# EasyEDA Pro project 电机控制板.epro

# Schematic Schematic1_2
Create Date: 2024-06-06; Page Name: P1; Project Name: 非小车电路板; Schematic Name: Schematic1_2; Update Date: 2024-06-06; Company: 嘉立创EDA; Page Size: A4; Version: V1.0
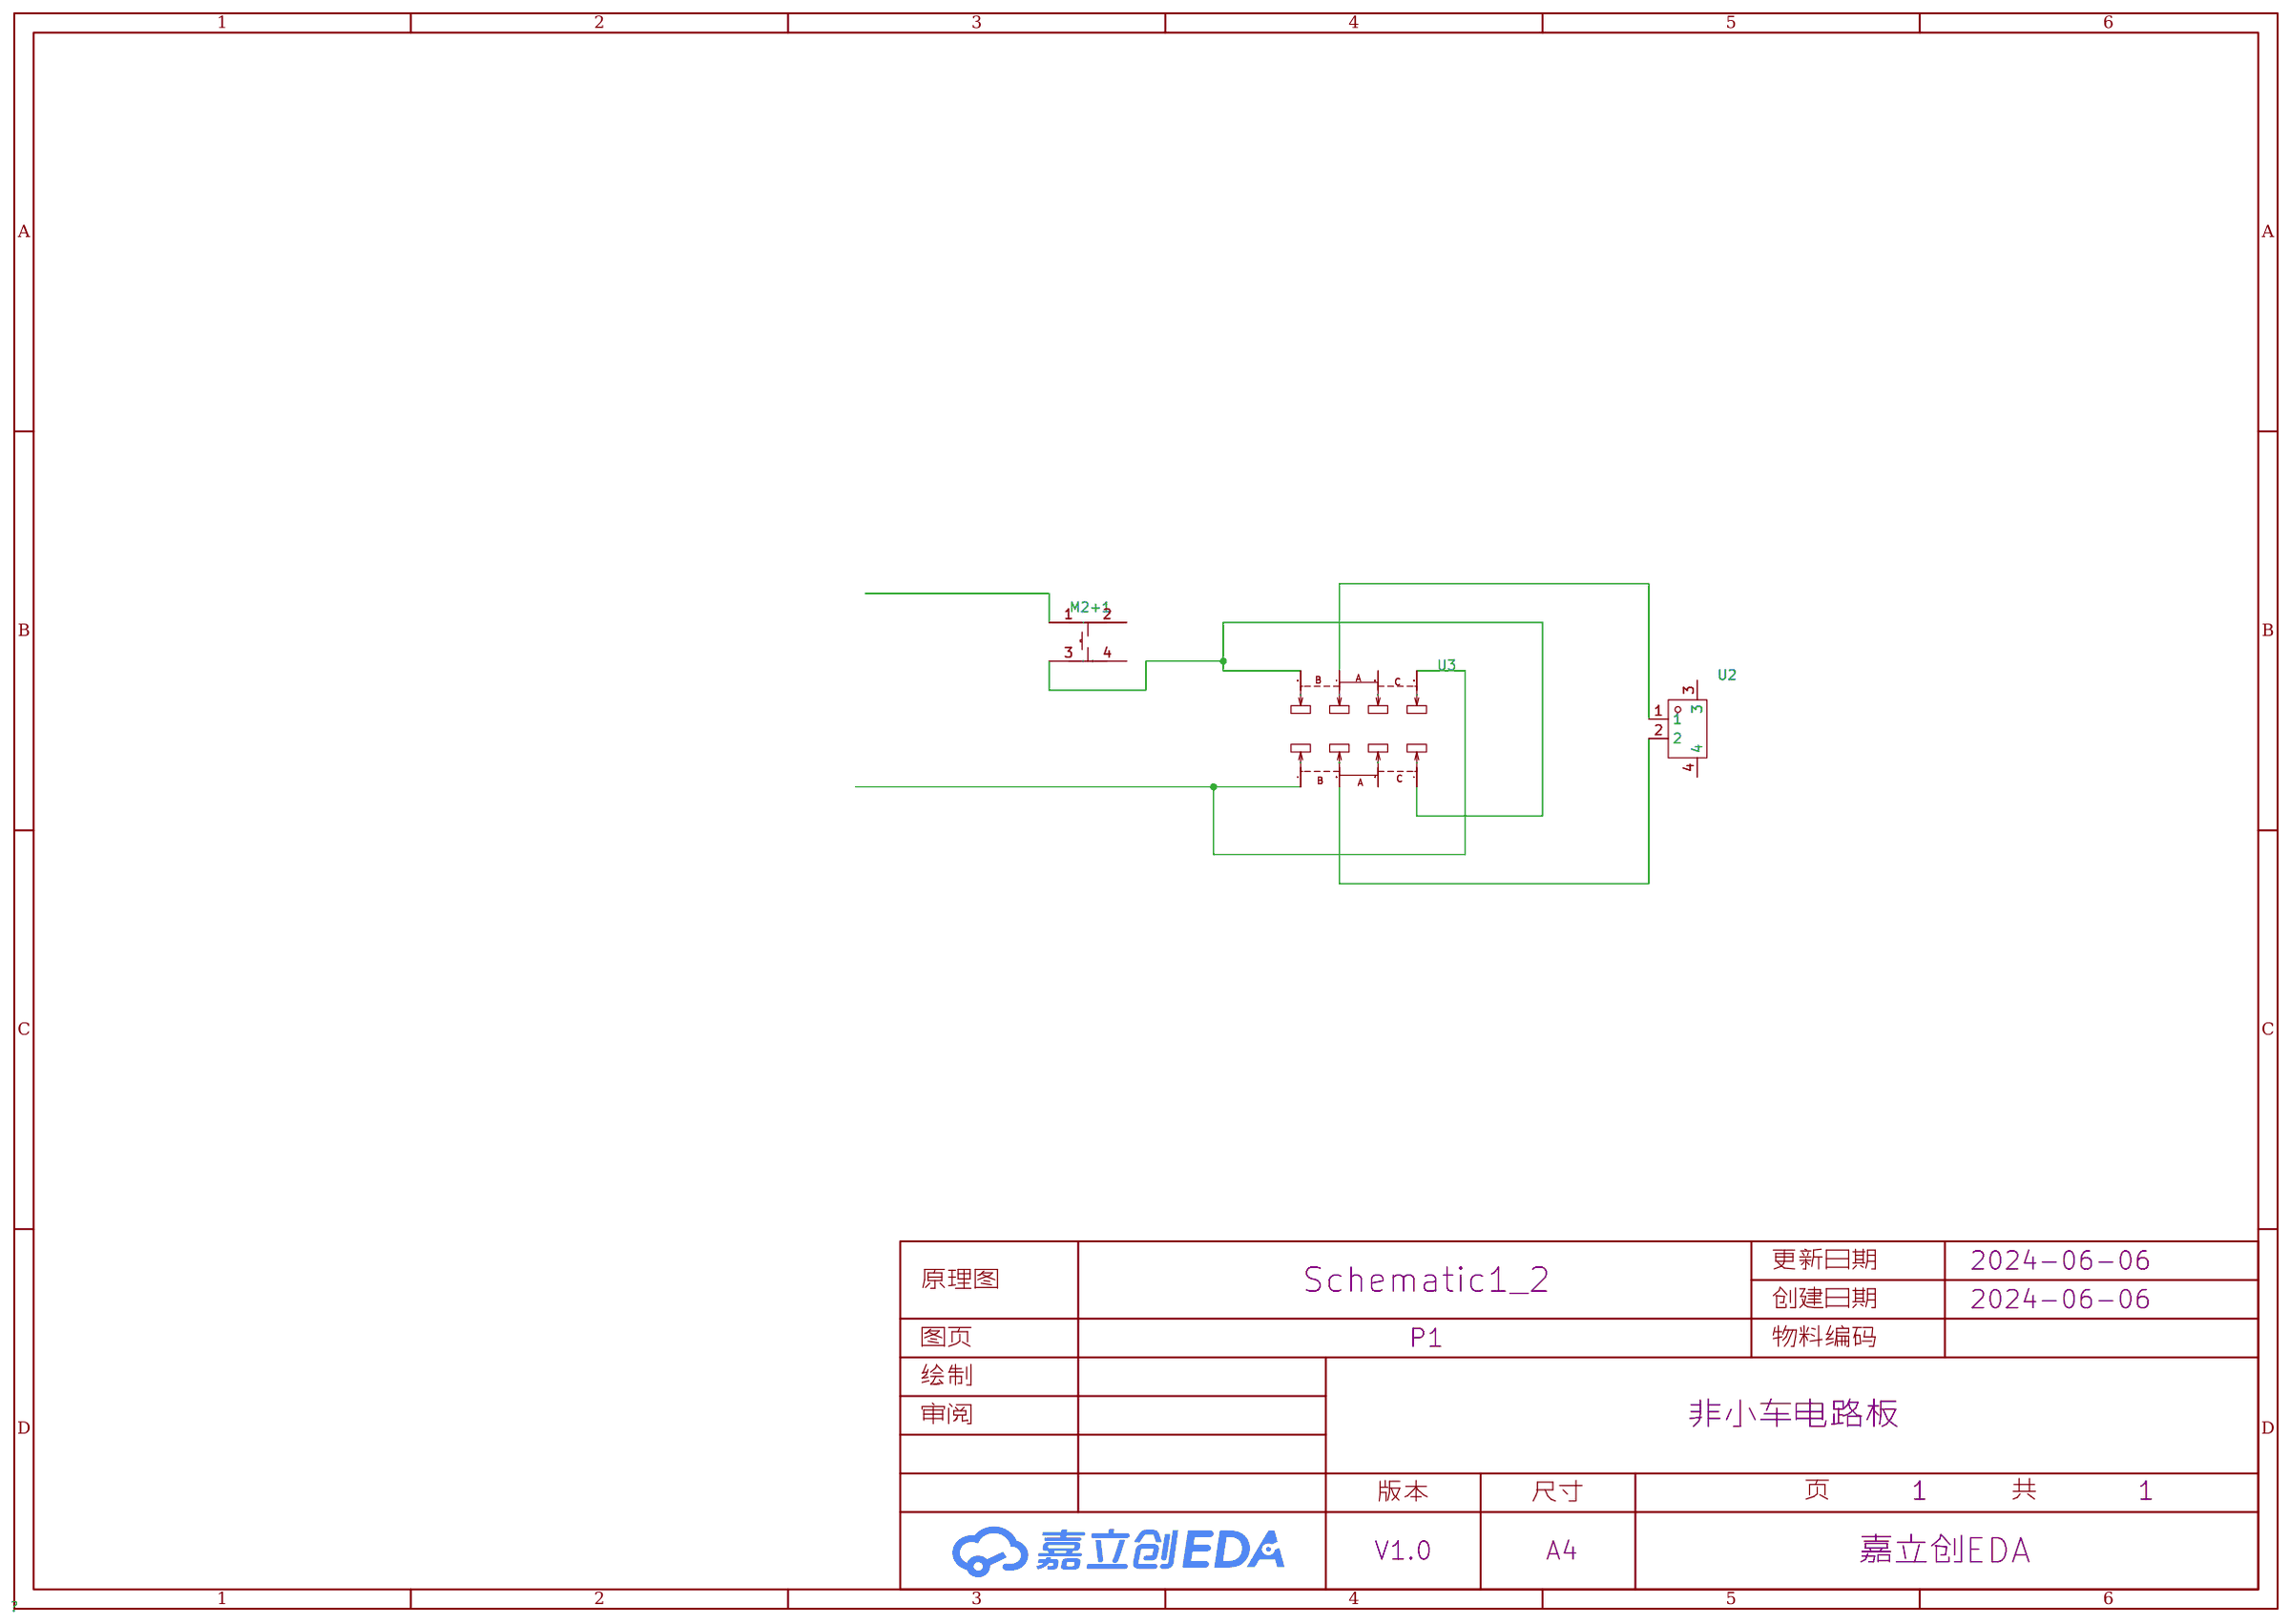
[diagram p0: schematic sheet]

## Parts
M2+1  TS-1095S-A1B3-C2D1  [SW-SMD_4P-L6.0-W6.0-P4.50-LS8.5]
U2  XD-GH-2PWT  [CONN-SMD_GH-2PWT]
U3  HX MST23D18G2  [SW-SMD_SHOU_MST23D18G2]

## Library data of the parts
M2+1 = TS-1095S-A1B3-C2D1: 电路结构:单刀单掷;按钮作用方向:顶部触动;致动器样式:圆形按钮;照明颜色:-;作用力:250gf ±30gf;开关长度:6mm;开关宽度:6mm;开关高度:4.3mm;; LCSC Part Name: 轻触开关6*6*4.3mm贴片四脚SMD黑柄250gf; Supplier Part: C493061; Manufacturer: Yuandi(元迪); JLCPCB Part Class: 扩展库; Datasheet: https://atta.szlcsc.com/upload/public/pdf/source/20200316/C493020_660A0B796DFD577DFFC16EBBCF440F36.pdf; Supplier: LCSC; Circuit: 单刀单掷; Actuator Orientation: 顶部触动; Actuator Style: 圆形按钮; Operating Force: 250gf ±30gf; Switch Length: 6mm; Switch Width: 6mm; Switch Height: 4.3mm
U2 = XD-GH-2PWT: 参考系列:GH;间距:1.25mm;插针结构:1x2P;排数:1;每排PIN数:2;公母:公型插针;安装方式:卧贴;额定电流:1A;触头镀层:锡;工作温度范围:-40℃~+105℃;; LCSC Part Name: 间距:1.25mm 1x2P 卧贴 带扣 线对板/线对线连接器; Supplier Part: C17700380; Manufacturer: XUNDA(讯答); Supplier Footprint: SMD,P=1.25mm; Datasheet: https://atta.szlcsc.com/upload/public/pdf/source/20231019/0574E105206498063B39A8D5088E5395.pdf; Supplier: LCSC; Reference Series: GH; Pitch: 1.25mm; Pins Structure: 1x2P; Number of Rows: 1; Number of PINs Per Row: 2; Gender: 公型插针; Mounting Style: 卧贴; Current Rating (Max): 1A; Contact Plating: 锡; Operating Temperature Range: -40℃~+105℃
U3 = HX MST23D18G2: 开关长度:13mm;开关宽度:3.5mm;开关高度:3mm;机械寿命:-;; LCSC Part Name: 拨动开关/三档立式 8脚贴片 柄长2.0mm  大八立贴 13*3.5mm; Supplier Part: C5149823; Manufacturer: hanxia(韩下); Supplier Footprint: SMD; JLCPCB Part Class: 扩展库; Datasheet: https://atta.szlcsc.com/upload/public/pdf/source/20220907/3EADCDC300B814542A94D0E1452EAE20.pdf; Supplier: LCSC; Switch Length: 13mm; Switch Width: 3.5mm; Switch Height: 3mm

## Nets
$1N862: M2+1.3 U3.4 U3.8
$1N921: U3.1 U3.5
Net-(U2-1): U2.1 U3.7
Net-(U2-2): U2.2 U3.2

Not connected (* = marked no-connect by the designer): M2+1 1 2 4; U2 3 4; U3 3 6

# Board PCB1_2
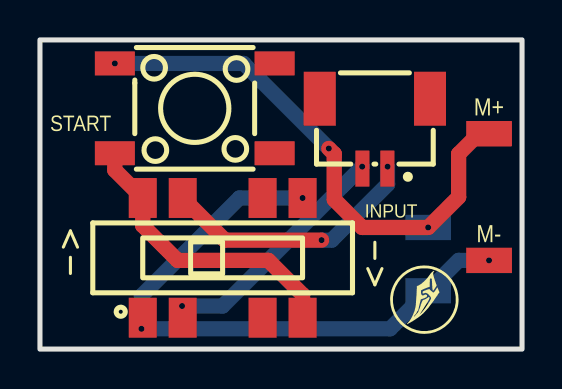
[diagram p1: board, top side]
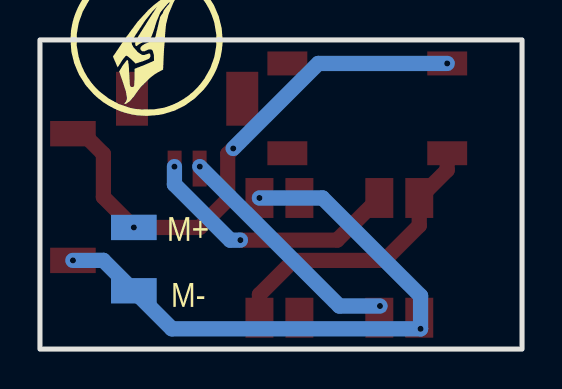
[diagram p2: board, bottom side, seen from below]

Outline 24.13 x 15.49 mm; copper layers: Top Layer, Bottom Layer. Coordinates in mm from the lower left corner of the outline.
Outline path: rectangle 0,15.49 24.13,0
Stack: Top Layer 0.035mm / Dielectric1 1.51mm FR4 er 4.5 / Bottom Layer 0.035mm

## Design rules (mm)
template: JLCPCB Capability(Two Layers Board)
spacing copperThickness1oz (default): track to track 0.102, other pairs 0.152 to 0.3
spacing copperThickness2oz: track to track 0.203, other pairs 0.152 to 0.3
track width copperThickness1oz (default): min 0.127, default 0.254, max 2.54
track width copperThickness2oz: min 0.203, default 0.254, max 2.54
differential pair differentialPair (default): width min 0.127, default 0.254, max 2.54; gap min 0.152, default 0.152
via viaSize (default): diameter min 0.5, default 0.61, max 10; hole min 0.3, default 0.305, max 6.3

## Placement (name value [footprint] x y rotation side)
INPUT  XD-GH-2PWT  [CONN-SMD_GH-2PWT]  16.76 10.8 180 top
M2+1  TS-1095S-A1B3-C2D1  [SW-SMD_4P-L6.0-W6.0-P4.50-LS8.5]  7.75 12.06 0 top
NOREF  -  [Pad_e94]  22.48 4.45 0 top
NOREF#2  -  [Pad_e10]  22.48 10.8 0 top
NOREF#3  -  [Pad_e51]  19.43 6.1 0 top
NOREF#4  -  [Pad_e114]  19.43 2.92 0 top
U3  HX MST23D18G2  [SW-SMD_SHOU_MST23D18G2]  9.14 4.57 0 top

## Footprints (pads in the part's own frame, mm; a bottom-side part is the same pattern mirrored in y, then rotated)
CONN-SMD_GH-2PWT
  rect 0.7x1.8 smd: 1(-0.625,1.75) 2(0.625,1.75)
  rect 1.6x2.7 smd: 3(-2.76,-1.75) 4(2.76,-1.75)
Pad_e10
  rect 2.286x1.27 smd: 1(0,0)
Pad_e51
  rect 2.286x1.27 smd far side: 1(0,0)
Pad_e94
  rect 2.286x1.27 smd: 1(0,0)
Pad_e114
  rect 2.286x1.27 smd far side: 1(0,0)
SW-SMD_4P-L6.0-W6.0-P4.50-LS8.5
  rect 2x1.2 smd: 1(-4,2.25) 2(4,2.25) 3(-4,-2.25) 4(4,-2.25)
SW-SMD_SHOU_MST23D18G2
  rect 1.4x2 smd: 1(-4,-3) 2(-2,-3) 3(2,-3) 4(4,-3) 5(4,3) 6(2,3) 7(-2,3) 8(-4,3)

## Nets
$1N135: M2+1.1 NOREF#2.1 NOREF#3.1
$1N862: M2+1.3 U3.4 U3.8
$1N870: INPUT.1 U3.7
$1N875: INPUT.2 U3.2
$1N921: NOREF.1 NOREF#4.1 U3.1 U3.5

Pads without a net: INPUT 3 4; M2+1 2 4; U3 3 6

## Via types
v1: diameter 0.61, hole 0.305, Top Layer to Bottom Layer, 10 vias

## Routing (per net, layer and track width the routed paths; a pad name or vN(x,y) marks a point on that pad's centre or on a via; arc(x,y) is an arc through that point)
$1N135: length 26.7
  Top Layer w0.762: v1(14.46,10.05) 14.73,9.78 14.73,7.49 16.13,6.1 v1(19.43,6.1) 20.96,7.62 20.96,9.78 21.97,10.8 NOREF#2.1
  Bottom Layer w0.762: v1(3.75,14.31) 10.2,14.31 v1(14.46,10.05)
$1N862: length 14.8
  Top Layer w0.762: M2+1.3 3.75,8.97 U3.8 5.14,6.19 6.89,4.45 11.43,4.45 13.14,2.73 U3.4
$1N870: length 13.2
  Top Layer w0.762: U3.7 9.25,5.46 v1(14.1,5.46)
  Bottom Layer w0.762: v1(14.1,5.46) 14.6,5.46 17.4,8.26 v1(17.4,9.14)
$1N875: length 11.9
  Bottom Layer w0.762: v1(7.11,2.16) 9.14,2.16 v1(16.13,9.14)
$1N921: length 30.6
  Bottom Layer w0.762: v1(13.14,7.57) 9.98,7.57 5.08,2.67 v1(5.08,1.02) 17.53,1.02 NOREF#4.1 20.96,4.45 v1(22.48,4.45)

## Text on the board
Bottom Silkscreen Layer: M- | M+
Top Silkscreen Layer: -> | START | M+ | M-
